# EAGLE board main (EAGLE 5.11)
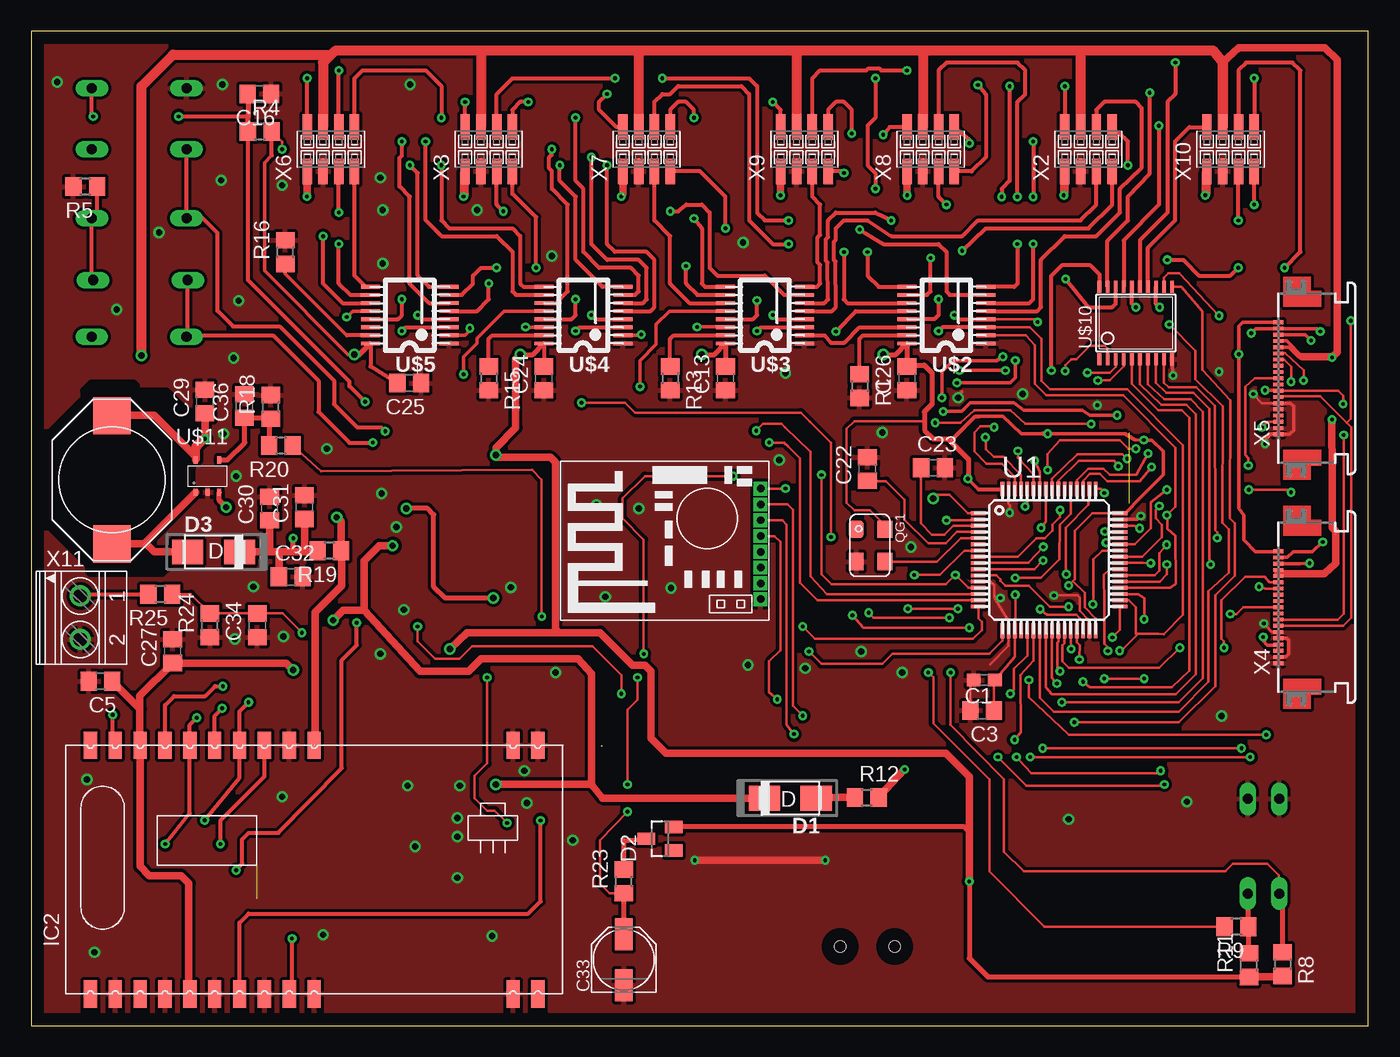
[diagram p3: board, top side]
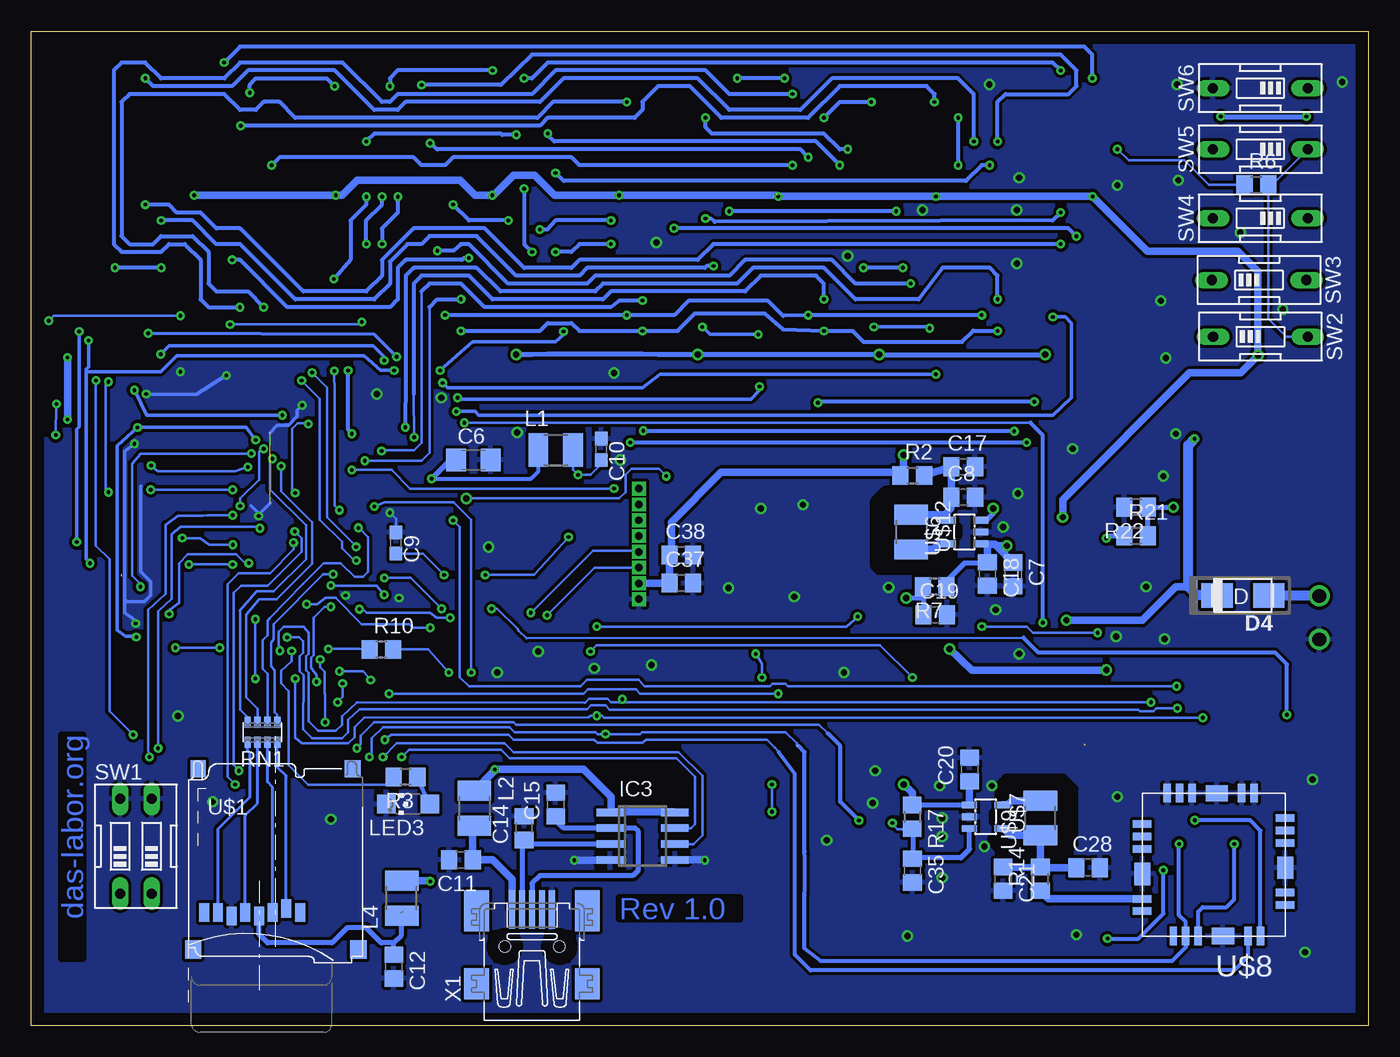
[diagram p4: board, bottom side, seen from below]

Size 107.62 x 80 mm. Coordinates in mm from the lower left corner, seen from the top.
Outline: 0,0 107.62,0 107.62,80 0,80 0,0
Copper layers (1*16): Top 0.035mm / dielectric 1.5mm / Bottom 0.035mm
Design rules "default *": minimum track width 0.15mm, minimum drill 0.3mm, track to track 0.15mm, track to pad 0.15mm, pad to pad 0.15mm, via to via 0.15mm, smd to smd 0.15mm, copper to edge 40mil, drill to drill 0.3mm, minimum pad ring 10mil, minimum via ring 8mil, stop-mask expansion 0.15mm, vias tented up to drill 0mil, thermal gap 10mil
tRestrict: area 1.4,37.1 to 12.9,50.5; area 8.3,47.1 to 13.4,51; area 4.7,36.5 to 11.1,38.2; area 4.3,50.8 to 8.4,51.6
bRestrict: area 33.5,36.6 to 39.8,43.1; area 27.2,13.6 to 30.3,15.2; area 23.7,13.8 to 29.8,19.9; area 25.1,15.9 to 30.2,17.4; area 33,39.2 to 38.1,40.5

## Footprints (pad centres in the part's own frame; a part is rotated, then mirrored left to right if it is on the bottom)
C0603 = smd 1.1 x 1: 1 -0.85,0; 2 0.85,0
C0805 = smd 1.3 x 1.5: 1 -0.95,0; 2 0.95,0
C1206 = smd 1.6 x 1.8: 1 -1.4,0; 2 1.4,0
PANASONIC_C = smd 2.6 x 1.4: + 2.05,0; - -2.05,0
DSMA = smd 2.5 x 2: A -2.083,0; C 2.083,0
SOT23 = smd 1 x 1.4: 1 -0.95,-1.1; 2 0.95,-1.1; 3 0,1.1
RFM_BP = smd 1.067 x 2.184: 1 30.62,13.65; 2 28.62,13.65; 3 12.62,13.65; 4 10.62,13.65; 5 8.62,13.65; 6 6.62,13.65; 7 4.62,13.65; 8 2.62,13.65; 9 0.62,13.65; 10 -1.38,13.65; 11 -3.38,13.65; 12 -5.38,13.65; 13 -5.38,-6.35; 14 -3.38,-6.35; 15 -1.38,-6.35; 16 0.62,-6.35; 17 2.62,-6.35; 18 4.62,-6.35; 19 6.62,-6.35; 20 8.62,-6.35; 21 10.62,-6.35; 22 12.62,-6.35; 23 28.62,-6.35; 24 30.62,-6.35
SO08 = smd 0.6 x 2.2: 1 -1.905,-2.6; 2 -0.635,-2.6; 3 0.635,-2.6; 4 1.905,-2.6; 5 1.905,2.6; 6 0.635,2.6; 7 -0.635,2.6; 8 -1.905,2.6
L1210 = smd 1.6 x 2.7: 1 -1.4,0; 2 1.4,0
PISM = smd 3 x 3: 1 -5.15,0; 2 5.15,0
CHIPLED_1206 = smd 1.5 x 1.5: A 0,-1.75; C 0,1.75
XO53 = smd 1.4 x 1.2: P$1 -1.3,-1.1; P$2 1.3,-1.1; P$3 1.3,1.2; P$4 -1.3,1.2
R0805 = smd 1.3 x 1.5: 1 -0.95,0; 2 0.95,0
CTS742C083 = smd 0.5 x 0.9: 1 -1.2,-0.8; 2 -0.4,-0.8; 3 0.4,-0.8; 4 1.2,-0.8; 5 1.2,0.8; 6 0.4,0.8; 7 -0.4,0.8; 8 -1.2,0.8
EDG-02 = drill 0.813 long: 1 -1.27,-3.81; 2 1.27,-3.81; 3 1.27,3.81; 4 -1.27,3.81
EDG-01 = drill 0.813 long: 1 0,-3.81; 2 0,3.81
TQFP64 = smd 1.2 x 0.3: 1 -5.7,3.75; 2 -5.7,3.25; 3 -5.7,2.75; 4 -5.7,2.25; 5 -5.7,1.75; 6 -5.7,1.25; 7 -5.7,0.75; 8 -5.7,0.25; 9 -5.7,-0.25; 10 -5.7,-0.75; 11 -5.7,-1.25; 12 -5.7,-1.75; 13 -5.7,-2.25; 14 -5.7,-2.75; 15 -5.7,-3.25; 16 -5.7,-3.75; 33 5.7,-3.75; 34 5.7,-3.25; 35 5.7,-2.75; 36 5.7,-2.25; 37 5.7,-1.75; 38 5.7,-1.25; 39 5.7,-0.75; 40 5.7,-0.25; 41 5.7,0.25; 42 5.7,0.75; 43 5.7,1.25; 44 5.7,1.75; 45 5.7,2.25; 46 5.7,2.75; 47 5.7,3.25; 48 5.7,3.75 | smd 0.3 x 1.2: 17 -3.75,-5.7; 18 -3.25,-5.7; 19 -2.75,-5.7; 20 -2.25,-5.7; 21 -1.75,-5.7; 22 -1.25,-5.7; 23 -0.75,-5.7; 24 -0.25,-5.7; 25 0.25,-5.7; 26 0.75,-5.7; 27 1.25,-5.7; 28 1.75,-5.7; 29 2.25,-5.7; 30 2.75,-5.7; 31 3.25,-5.7; 32 3.75,-5.7; 49 3.75,5.7; 50 3.25,5.7; 51 2.75,5.7; 52 2.25,5.7; 53 1.75,5.7; 54 1.25,5.7; 55 0.75,5.7; 56 0.25,5.7; 57 -0.25,5.7; 58 -0.75,5.7; 59 -1.25,5.7; 60 -1.75,5.7; 61 -2.25,5.7; 62 -2.75,5.7; 63 -3.25,5.7; 64 -3.75,5.7
ALPS_MICROSD = smd 0.8 x 1.5: 1 3.25,-3.25; 2 2.15,-2.95; 3 1.05,-3.25; 4 -0.05,-3.55; 5 -1.15,-3.25; 6 -2.25,-3.55; 7 -3.35,-3.25; 8 -4.45,-3.25 | smd 1.3 x 1.5: NC 7.95,-6.25; NC3 -5.35,-6.25 | smd 1.2 x 1.4: SW1 -4.95,8.3 | smd 1.3 x 1.4: SW2 7.5,8.3
TSSOP16 = smd 0.305 x 1.524: 1 -2.275,-3.169; 2 -1.625,-3.169; 3 -0.975,-3.169; 4 -0.325,-3.169; 5 0.325,-3.169; 6 0.975,-3.169; 7 1.625,-3.169; 8 2.275,-3.169; 9 2.275,3.169; 10 1.625,3.169; 11 0.975,3.169; 12 0.325,3.169; 13 -0.325,3.169; 14 -0.975,3.169; 15 -1.625,3.169; 16 -2.275,3.169
SOT23-5L = smd 0.55 x 1.2: 1 -0.95,-1.3; 2 0,-1.3; 3 0.95,-1.3; 4 0.95,1.3; 5 -0.95,1.3
SIM18 = smd 1.5 x 0.6: 1 -6,3; 2 -6,2; 4 -6,-2; 5 -6,-3; 6 -6,-4; 13 5.5,-3.5; 14 5.5,-2.5; 15 5.5,-1.5; 17 5.5,2.5; 18 5.5,3.5 | smd 0.6 x 1.5: 7 -3.5,-6; 8 -2.5,-6; 10 1.5,-6; 11 2.5,-6; 12 3.5,-6; 19 3,5.5; 20 2,5.5; 21 1,5.5; 23 -3,5.5; 24 -4,5.5 | smd 1.3 x 1.8: GND1 -6,0; GND3 5.5,0.5 | smd 1.8 x 1.3: GND2 -0.5,-6; GND4 -1,5.5
TSSOP20 = smd 0.305 x 0.991: 1 -2.925,-2.918; 2 -2.275,-2.918; 3 -1.625,-2.918; 4 -0.975,-2.918; 5 -0.325,-2.918; 6 0.325,-2.918; 7 0.975,-2.918; 8 1.625,-2.918; 9 2.275,-2.918; 10 2.925,-2.918; 11 2.925,2.918; 12 2.275,2.918; 13 1.625,2.918; 14 0.975,2.918; 15 0.325,2.918; 16 -0.325,2.918; 17 -0.975,2.918; 18 -1.625,2.918; 19 -2.275,2.918; 20 -2.925,2.918
TSOT23-5 = smd 0.33 x 0.584: 1 -0.95,-1.3; 2 0,-1.3; 3 0.95,-1.3; 4 0.95,1.3; 5 -0.95,1.3
RFM70 = drill 0.6 pad 0.61 square: P$1 -4.7,-7.7; P$2 -3.429,-7.7; P$3 -2.159,-7.7; P$4 -0.889,-7.7; P$5 0.381,-7.7; P$6 1.651,-7.7; P$7 2.921,-7.7; P$8 4.191,-7.7
32005-201 = smd 3.1 x 0.5: 1 3,1.6; 2 3,0.8; 3 3,0; 4 3,-0.8; 5 3,-1.6 | smd 2.5 x 2: M1 -3,-4.45; M2 -3,4.45 | smd 3.3 x 2: M3 2.9,4.45; M4 2.9,-4.45 | hole 0.9: 0,2.2; 0,-2.2
1296-08 = smd 0.76 x 2.05: 1 -1.905,-1.78; 2 -1.905,1.78; 3 -0.635,-1.78; 4 -0.635,1.78; 5 0.635,-1.78; 6 0.635,1.78; 7 1.905,-1.78; 8 1.905,1.78
52746-19 = smd 0.3 x 0.8: 1 -4.5,0.6; 2 -4,0.6; 3 -3.5,0.6; 4 -3,0.6; 5 -2.5,0.6; 6 -2,0.6; 7 -1.5,0.6; 8 -1,0.6; 9 -0.5,0.6; 10 0,0.6; 11 0.5,0.6; 12 1,0.6; 13 1.5,0.6; 14 2,0.6; 15 2.5,0.6; 16 3,0.6; 17 3.5,0.6; 18 4,0.6; 19 4.5,0.6
1751248 = drill 1.1 pad 1.7 round: 1 -1.75,-0.1; 2 1.75,-0.1

## Placement (x,y rotation side)
C1  100n  [C0603]  76.71,27.79 180 top
C3  100n  [C0805]  76.53,25.35 180 top
C5  100n  [C0805]  5.58,27.7 180 top
C6  4u7  [C1206]  72.03,45.51 0 bottom
C7  4µ7  [C0805]  28.6,36.3 270 bottom
C8  10µ  [C0805]  32.6,42.5 0 bottom
C9  100n  [C0603]  78.26,38.81 270 bottom
C10  100n  [C0603]  61.75,46.35 270 bottom
C11  10n  [C0805]  73.03,13.34 180 bottom
C12  4u7  [C0805]  78.44,4.74 270 bottom
C13  100n  [C0805]  55.88,52.07 90 top
C14  47p  [C0805]  67.94,15.88 90 bottom
C15  47p  [C0805]  65.41,17.78 90 bottom
C16  100n  [C0805]  18.38,74.94 180 top
C17  10µ  [C0805]  32.6,44.95 0 bottom
C18  100n  [C0805]  30.66,36.33 270 bottom
C19  100n  [C0805]  34.86,33.05 0 bottom
C20  4µ7  [C0805]  32.1,20.6 90 bottom
C21  10µ  [C0805]  29.4,11.8 270 bottom
C22  10p  [C0805]  67.3,44.77 90 top
C23  10p  [C0805]  72.58,44.88 0 top
C24  100n  [C0805]  41.27,52.07 90 top
C25  100n  [C0805]  30.43,51.68 180 top
C26  100n  [C0805]  70.48,52.07 90 top
C27  4u7  [C0805]  11.4,30.11 90 top
C28  10µ  [C0805]  22.55,12.7 0 bottom
C29  4µ7  [C0805]  14,50.2 90 top
C30  10µ  [C0805]  19.2,41.6 90 top
C31  10µ  [C0805]  22,41.7 90 top
C32  4µ7  [C0805]  20.9,36.1 0 top
C33  VF 100/6,3 K-C  [PANASONIC_C]  47.7,5.3 90 top
C34  100n  [C0805]  18.2,32.2 90 top
C35  100n  [C0805]  36.7,12.46 270 bottom
C36  220n  [C0805]  17.17,49.84 90 top
C37  100n  [C0805]  55.3,35.6 0 bottom
C38  1µ  [C0805]  55.3,37.85 0 bottom
D1  [DSMA]  61.1,18.3 180 top
D2  BAS70-05  [SOT23]  50.62,15.03 90 top
D3  [DSMA]  14.7,38.1 0 top
D4  [DSMA]  10.1,34.6 180 bottom
IC2  RFM12BP  [RFM_BP]  10.16,8.89 0 top
IC3  USB6B1  [SO08]  58.42,15.24 270 bottom
L1  10,0µ  [L1210]  65.4,46.3 0 bottom
L2  1,0µ  [L1210]  71.94,17.48 270 bottom
L3  L-EUPISM  [PISM]  6.5,43.9 270 top
L4  100µ  [L1210]  77.8,10.25 90 bottom
LED3  [CHIPLED_1206]  77.28,17.82 90 bottom
QG1  CRYSTALRESONATORXO53  [XO53]  67.5,38.62 270 top
R1  100k  [R0805]  66.67,51.44 270 top
R2  0  [R0805]  36.7,44.25 0 bottom
R3  330  [R0805]  77.49,19.99 180 bottom
R4  100k  [R0805]  18.4,71.94 0 top
R5  22k  [R0805]  4.36,67.48 180 top
R6  22k  [R0805]  9.02,67.64 0 bottom
R7  1k  [R0805]  34.9,35.3 180 bottom
R8  100k  [R0805]  100.7,4.94 270 top
R9  100k  [R0805]  96.99,7.95 180 top
R10  100k  [R0805]  79.44,30.26 0 bottom
R11  100k  [R0805]  98,4.86 90 top
R12  0  [R0805]  67.25,18.35 0 top
R13  100k  [R0805]  51.44,52.07 270 top
R14  0  [R0805]  26.4,11.8 90 bottom
R15  100k  [R0805]  36.83,52.07 270 top
R16  100k  [R0805]  20.46,62.22 90 top
R17  100k  [R0805]  36.71,16.79 270 bottom
R18  100k  [R0805]  19.3,49.77 90 top
R19  0  [R0805]  24,38.2 180 top
R20  10k  [R0805]  20.1,46.65 180 top
R21  84k5  [R0805]  18.7,39.4 0 bottom
R22  10k  [R0805]  18.7,41.7 180 bottom
R23  1k  [R0805]  47.7,11.6 90 top
R24  100k  [R0805]  14.4,32.2 90 top
R25  100k  [R0805]  10.4,34.7 180 top
RN1  742C083820JPCT-ND  [CTS742C083]  89,23.6 180 bottom
SW1  [EDG-02]  99.19,14.43 0 bottom
SW2  [EDG-01]  8.69,55.42 270 bottom
SW3  [EDG-01]  8.8,59.98 270 bottom
SW4  [EDG-01]  8.7,64.94 90 bottom
SW5  [EDG-01]  8.7,70.49 90 bottom
SW6  [EDG-01]  8.7,75.41 90 bottom
U1  STM32F10XRXT6  [TQFP64]  81.92,37.47 0 top
U$1  MICROSDA  [ALPS_MICROSD]  89.23,12.36 0 bottom
U$2  PCA9922  [TSSOP16]  73.66,57.15 90 top
U$3  PCA9922  [TSSOP16]  59.05,57.15 90 top
U$4  PCA9922  [TSSOP16]  44.45,57.15 90 top
U$5  PCA9922  [TSSOP16]  30.48,57.15 90 top
U$6  LM3671  [SOT23-5L]  32.5,39.7 90 bottom
U$7  XC9235  [SOT23-5L]  30.8,16.8 270 bottom
U$8  SIM18  [SIM18]  12.7,12.7 180 bottom
U$9  LQH3C 4,7µ  [L1210]  26.4,16.7 90 bottom
U$10  74AHC573  [TSSOP20]  88.9,56.52 0 top
U$11  LT1935  [TSOT23-5]  14.2,44.2 0 top
U$12  2,2µ  [L1210]  36.8,39.7 270 bottom
U$13  RFM70  [RFM70]  51,39 90 top
X1  MINI-USB-32005-201  [32005-201]  67.31,6.35 90 bottom
X2  1296-T08  [1296-08]  85.09,70.48 0 top
X3  1296-T08  [1296-08]  36.83,70.48 0 top
X4  52746-19  [52746-19]  100.97,33.66 90 top
X5  52746-19  [52746-19]  100.97,52.07 90 top
X6  1296-T08  [1296-08]  24.13,70.48 0 top
X7  1296-T08  [1296-08]  49.53,70.48 0 top
X8  1296-T08  [1296-08]  72.39,70.48 0 top
X9  1296-T08  [1296-08]  62.23,70.48 0 top
X10  1296-T08  [1296-08]  96.52,70.48 0 top
X11  1751248  [1751248]  4.06,32.81 270 top

## Tracks (layer width: path | path; a pad name or v marks a point on that pad's centre or on a via)
B1  (via drill 0.3)
  Top 0.305: U$4.5 49.85,57.48 50.16,57.78 50.16,61.59 49.53,62.23 46.99,62.23 46.35,62.87 v46.35,69.22 | v88.27,69.22 88.27,71.12 87.63,71.75 87.5,71.75 X2.8
  Bottom 0.305: v46.35,69.22 63.5,69.22 64.14,69.85 73.66,69.85 74.3,69.22 76.2,69.22 76.83,69.85 87.63,69.85 v88.27,69.22
B2  (via drill 0.3)
  Top 0.305: U$4.6 49.23,58.12 49.53,58.42 49.53,60.96 48.9,61.59 46.35,61.59 45.09,62.87 v45.09,69.85 | v75.52,70.97 75.49,71.27 X8.8
  Bottom 0.305: v45.09,69.85 45.72,70.48 74.93,70.48 v75.52,70.97
B3  (via drill 0.3)
  Top 0.305: U$4.7 48.62,58.77 48.9,59.05 48.9,60.33 48.26,60.96 45.72,60.96 44.45,62.23 44.45,67.31 43.81,67.94 v43.81,73.03 | X3.8 38.73,73.66 39.37,74.3 v40.01,74.3
  Bottom 0.305: v43.81,73.03 42.55,74.3 v40.01,74.3
B4  (via drill 0.3)
  Top 0.305: U$4.8 45.98,59.42 43.81,61.59 43.81,66.67 42.55,67.94 v42.55,69.22 | v66.04,71.75 66.04,73.66 65.41,74.3 64.77,74.3 64.14,73.66 X9.8
  Bottom 0.305: v42.55,69.22 44.45,71.12 65.53,71.12 66.04,71.63 v66.04,71.75
B5  (via drill 0.3)
  Top 0.305: U$4.9 39.63,59.42 39.37,59.69 39.37,63.5 38.73,64.14 33.66,64.14 33.02,64.77 v33.02,69.22 | X6.8 26.04,76.2 26.67,76.83 31.75,76.83 33.02,75.56 v33.02,73.03
  Bottom 0.305: v33.02,73.03 v33.02,69.22
B6  (via drill 0.3)
  Top 0.305: U$4.10 39.02,58.77 38.73,59.05 38.73,62.23 37.47,63.5 33.02,63.5 31.75,64.77 v31.75,71.12 | v98.42,76.2 X10.8
  Bottom 0.305: v31.75,71.12 31.75,74.93 33.02,76.2 43.18,76.2 45.72,73.66 51.44,73.66 53.98,76.2 64.77,76.2 66.67,74.3 77.47,74.3 78.11,73.66 80.01,73.66 83.19,76.83 90.17,76.83 91.44,75.56 97.79,75.56 v98.42,76.2
B7  (via drill 0.3)
  Top 0.305: U$4.11 42.25,58.12 43.18,59.05 43.18,66.04 41.91,67.31 41.91,68.74 41.7,68.95 41.7,69.85 41.9,70.05 v41.91,70.48 | X7.8 51.44,73.66 52.07,74.3 52.7,74.3 53.34,73.66 v53.34,73.03
  Bottom 0.305: v41.91,70.48 42.55,70.48 43.81,71.75 52.83,71.75 53.34,72.27 v53.34,73.03
B8  (via drill 0.3)
  Top 0.3: X5.19 97.51,56.57 97.19,56.25 v97.19,54 97.2,41.6 97.59,41.06 97.59,39.06 98.53,38.12 100.33,38.12 | U$4.12 38.08,57.48 35.9,55.3 35.9,54.9 34.8,53.8 v34.8,52.4 | v74.5,51.7 78.8,51.7 79.2,52.1 v79.2,53.5
  Top 0.305: 100.33,38.12 X4.19
  Bottom 0.3: v34.8,52.4 57,52.4 58.4,51.3 74.1,51.3 v74.5,51.7 | v79.2,53.5 79.2,53.8 80.1,54.7 96.49,54.7 v97.19,54
BATTERY
  Top 0.305: R25.2 4.1,34.7 X11.1
  Bottom 0.813: X11.1 7.98,34.56 D4.A
BOOT0  (via drill 0.3)
  Top 0.2: U1.60 80.17,41.91 v80,41.75 | R9.2 81.55,7.95 77.1,12.4 77.1,19.8 72.6,24.3 72.6,28 v72.2,28.4
  Bottom 0.2: v72.2,28.4 72.2,40.7 73.6,42.1 79.15,42.1 v80,41.75
G1
  Top 0.305: U$3.5 64.46,57.48 64.77,57.78 64.75,61.45 64.6,61.6 64.6,63.05 64.77,63.22 64.77,64.14 65.41,64.77 67.31,64.77 69.22,63.5 74.93,63.5 76.2,64.77 84.45,64.77 85.72,66.04 X2.5
G2  (via drill 0.3)
  Top 0.305: U$3.6 63.84,58.12 64.14,58.42 64.1,61.4 63.95,61.55 63.95,63.25 64.14,63.44 64.14,64.77 64.77,65.41 67.94,65.41 v69.22,64.77 | v73.66,66.04 73.03,66.67 X8.5
  Bottom 0.305: v73.66,66.04 72.39,64.77 v69.22,64.77
G3  (via drill 0.3)
  Top 0.305: U$3.7 60.6,58.77 59.05,60.33 55.24,60.33 54.61,60.96 54.61,65.41 53.98,66.04 52.7,66.04 52.07,65.5 v51.44,65.5 | X3.5 37.47,66.04 v38,65.5
  Bottom 0.305: v38,65.5 38.2,65.5 38.3,65.5 v51.44,65.5
G4
  Top 0.305: U$3.8 63.23,59.42 63.5,59.69 63.5,61.2 63.3,61.4 63.3,63.4 63.5,63.6 63.5,66.04 62.87,66.67 X9.5
G5  (via drill 0.3)
  Top 0.305: U$3.9 54.24,59.42 53.98,59.69 53.98,64.14 v53.34,64.92 | v24.77,65.41 X6.5
  Bottom 0.305: v53.34,64.92 52.92,64.92 52.6,64.65 25.4,64.77 v24.77,65.41
G6  (via drill 0.3)
  Top 0.305: v97.16,64.77 X10.5 | U$3.10 53.62,58.77 52.7,59.69 v52.7,61.11
  Bottom 0.305: v52.7,61.11 53.24,61.11 53.4,60.95 62.87,60.96 63.5,60.33 68.58,60.33 71.75,63.5 75.56,63.5 76.2,62.87 77.32,62.87 78.74,61.45 78.74,59.69 80.01,58.42 86.36,58.42 90.81,62.87 92.71,62.87 94.61,64.77 v97.16,64.77
G7
  Top 0.305: X7.5 50.16,64.77 51.44,63.5 51.44,59.69 53,58.12 U$3.11
G8  (via drill 0.3)
  Top 0.3: v103.74,55.84 103.5,56.07 X5.18 98.57,56.07 v98.2,55.7 | X4.18 101.09,37.66 101.56,38.12 103.11,38.12 v103.94,38.9 | U$3.12 51.38,57.48 50.3,56.4 50.3,54.8 49,53.5 v49,51.4 | v73.3,50.5 73.3,52.6 74.2,53.5 77.7,53.5 v78.2,53.8
  Bottom 0.3: v103.74,55.84 103.74,48.16 103.95,47.95 v103.94,38.9 | v49,51.4 49,51.1 49.7,50.4 73.1,50.4 v73.3,50.5 | v78.2,53.8 80,55.6 v98.2,55.7
GND  (via drill 0.3, 0.5)  (1 unrouted)
  Top 0.2: U1.63 78.67,41.96 78.75,41.88 v78.75,41.25 | U1.12 77.21,35.72 77.51,35.41 77.51,34.4 78.67,32.55 U1.18 | U1.18 78.67,30.54 77.19,29.06 | X5.5 X5.6 99.03,50.07 v98.35,50.8 | 91.8,53.37 U$10.10 | U1.18 78.67,31.86 78.7,31.9 | U1.31 85.14,31.77 85.1,31.8 85.1,32.65 84.4,33.35 84.4,34.4 84.2,34.6 v82.3,34.6 | C3.2 75.58,27.62 C1.2
  Top 0.25: X4.2 X4.1 | X4.6 99.89,31.66 v99.2,32.35
  Top 0.3: X5.1 101.27,47.57 101.6,47.9 101.6,49.8 101.33,50.07 X5.6 | X5.1 X5.2 | v91.9,52.3 91.8,53.37 | X4.6 X4.5 101.05,31.16 101.2,31 101.2,29.9 100.95,29.66 X4.2 | v99.3,46.8 99.3,47.1 99.8,47.6 100.33,47.6 X5.1 | U1.47 89.02,40.72 v89.3,41 | 74.4,50.5 74.9,51
  Top 0.61: v53.4,13.3 v63.9,13.3
  Bottom 0.2: C9.1 78.26,40.76 v78.75,41.25 | v82.3,34.6 82.2,34.6
  Bottom 0.3: v98.35,50.8 94.3,50.8 v91.9,52.3 | v99.2,32.35 99.25,32.6 100.1,33.2 100.1,34.3 | 100.1,34.3 100.1,46.2 v99.3,46.8 | 89.9,41.8 89.3,41.2 v89.3,41 89.3,41.1 88.4,42 | 98.8,43.4 98.8,36.5 98,35.7 98,34.6 98.5,34.1 99.9,34.1 100.1,34.3 | 88.4,47.7 87.8,48.3 86.9,48.3 86.2,49 86.2,49.5 v85.8,49.9
  Bottom 0.61: IC3.5 53.44,13.34 v53.4,13.3 | v63.9,13.3 61.05,13.3 IC3.4
  other vias: 34.3,15.2 34.3,16.7 30.9,14.4 34.5,19.3 30.3,19.3 34.3,11.9 16.5,44.2 15.5,47.6 20.3,31.3 39.9,17.9 43.6,14.9 17.9,35.3 30,33.45 29.4,40.1 38.6,35.25 28.2,42.8 78,34.4 39.7,20.5 28.1,29.9 42.2,28.4 62.3,28.75 57.7,29 70.1,28.4 83.5,16.6 93,18 37.1,7.2 23.5,7.3 20.2,18.4 5.1,5.9 4.5,19.8 16.4,31.1 60.7,52.5 68.5,47.7 60.2,45.5 48.9,41.6 28.1,68.2 28.3,61.3 41.9,61.9 57.3,63 95.8,24.9 66.8,30.1 23.8,46.4 15.3,68 2.1,75.9 6.9,57.6 16.3,53.7 30.5,75.7 74.6,50.5 79.8,50.8 95.6,52.6 70.8,38.5 10.3,63.8 28.3,65.6 35.9,65.6 16.7,58.3 20.2,67.6 15.4,75.7 46.2,34.5 45.5,41.9 51.5,35.2
  pour Top (isolate 0.254): 0,0 107.95,0 107.95,80.01 0,80.01
  pour Bottom (isolate 0.254): 107.95,0 107.95,80.01 0,80.01 0,0
M1  (via drill 0.3)
  Top 0.305: U$5.5 35.88,57.48 36.83,58.42 v36.83,59.69 | X2.7 87,66.04 85.09,64.14 76.83,64.14 v74.93,62.33
  Bottom 0.305: v36.83,59.69 41.27,59.69 43.18,61.59 50.16,61.59 51.44,60.33 62.23,60.33 62.87,59.69 69.22,59.69 72.39,62.87 73.03,62.87 73.61,62.33 v74.93,62.33
M2  (via drill 0.3)
  Top 0.305: X8.7 75.69,68.7 76.83,69.85 76.83,74.93 v76.2,75.67 | v29.84,71.12 29.84,70 29.65,69.8 29.64,67.51 30.48,66.67 30.48,59.69 32.05,58.12 U$5.6
  Bottom 0.305: v76.2,75.67 69.8,75.67 67.31,78.11 24.77,78.11 23.5,76.83 23.5,75.56 24.13,74.93 29.21,74.93 29.84,74.3 v29.84,71.12
M3  (via drill 0.3)
  Top 0.305: X3.7 38.73,66.91 40.64,65.04 v40.64,60.96 | U$5.7 34.65,58.77 35.56,59.69 35.56,60.33 36.2,60.96 v37.47,60.96
  Bottom 0.305: v37.47,60.96 v40.64,60.96
M4  (via drill 0.3)
  Top 0.305: U$5.8 32.02,59.42 31.11,60.33 31.11,68.58 v30.48,69.22 | X9.7 65.28,68.7 v65.41,68.58
  Bottom 0.305: v30.48,69.22 31.11,69.22 32.38,67.94 64.77,67.94 v65.41,68.58
M5
  Top 0.305: U$5.9 26.93,59.42 26.04,60.33 X6.7
M6  (via drill 0.3)
  Top 0.305: U$5.10 25.68,58.77 24.77,59.69 v24.77,62.87 | v98.42,66.04 X10.7
  Bottom 0.305: v24.77,62.87 52.7,62.87 53.98,61.59 63.5,61.59 64.14,60.96 67.94,60.96 71.12,64.14 76.83,64.14 79.38,61.59 79.38,60.33 80.64,59.05 85.72,59.05 90.81,64.14 92.71,64.14 93.98,65.41 95.89,65.41 96.52,66.04 v98.42,66.04
M7  (via drill 0.3)
  Top 0.305: X7.7 53.85,68.7 55.88,66.67 v55.88,64.14 | v23.5,63.5 23.5,59.69 25.06,58.12 U$5.11
  Bottom 0.305: v55.88,64.14 24.13,64.14 v23.5,63.5
M8  (via drill 0.3)
  Top 0.2: X4.8 105.16,32.66 105.62,33.12 v105.62,47.5 | v105.58,50 105.58,50.67 105.18,51.07 X5.8
  Top 0.3: U$5.12 25.88,57.48 v25.4,57 | v73.4,49.4 74.9,49.4 75.6,50.1 79.1,50.1 79.9,49.5 84.6,49.5 85.2,49.1 v87.4,49.1 | v99.3,51.1 100.39,51.1 X5.8
  Bottom 0.2: v105.58,50 v105.62,47.5
  Bottom 0.3: v25.4,57 24.4,57 23.9,56.5 23.9,50.5 25.4,49.1 71.6,49.1 71.9,49.4 v73.4,49.4 | v87.4,49.1 98.3,49.1 v99.3,51.1
N$2  (via drill 0.3)
  Top 0.2: U1.13 75.41,35.22 v74.38,36.25 73.62,35.5 64.4,35.5 63.6,36.3 v63.6,44.3
  Bottom 0.2: C9.2 76.09,37.97 v74.38,36.25 | L1.2 64,44.7 v63.6,44.3 62.6,44.3 61.9,45 C10.2
N$3
  Top 0.406: R23.2 47.7,14.88 D2.3
N$4
  Bottom 0.406: U$1.4 89.28,7.33 88.6,6.64 83.4,6.65 82.2,7.85 80.65,7.85 79.44,6.64 78.44,6.64 | 78.44,6.64 77.8,7.28 L4.1 | C12.1 78.44,6.64
N$5
  Bottom 0.254: U$1.2 87.08,20.08 87.8,20.8 RN1.8
N$6
  Bottom 0.406: 72.08,15.89 71.94,15.89 L2.2
  Bottom 0.61: X1.1 68.91,11.76 70.48,13.34 C11.1 72.08,15.89
N$7
  Top 0.2: U1.4 74.52,39.72 73.6,38.8 72.2,38.8 70.3,40.7 70.3,42.3 68.8,43.8 67.33,43.8 C22.1
N$8
  Bottom 0.406: IC3.3 67.62,14.61 C14.1 68.11,14.76 X1.2
N$9
  Bottom 0.406: C15.1 65.41,16.51 64.77,15.88 IC3.2 59,15.88 58.75,15.62 58.75,12.5 59.19,12.06 66.67,12.06 67.31,11.43 X1.3
N$10
  Bottom 0.305: LED3.A R3.1
N$11
  Bottom 0.254: U$1.3 88.18,19.18 88.6,19.6 RN1.7
N$12
  Top 0.2: U1.3 74.22,40.22 73.5,39.5 72.5,39.5 71.6,40.4 71.6,44.85 C23.1
N$13
  Top 0.305: U$2.14 66.67,56.17 65.44,54.95 64.33,54.95 63.85,55.52 U$3.2
N$14  (via drill 0.3)
  Top 0.3: U$4.2 49.02,55.52 v49.1,55.6 | v53.6,56.2 55.86,56.2 U$3.14
  Bottom 0.3: v49.1,55.6 53,55.6 v53.6,56.2
N$15  (via drill 0.3)
  Top 0.3: U$4.14 39.92,56.17 v39.8,56.2 | v35.3,56.1 35.3,55.9 34.92,55.52 U$5.2
  Bottom 0.3: v39.8,56.2 35.4,56.2 v35.3,56.1
N$16  (via drill 0.3, 0.5)
  Top 0.61: L3.1 6.55,49.1 9.9,49.1 13.25,45.75 U$11.5 13.3,45.55 13.3,46.6 | v14,47.2 C29.1 | 26.8,33.4 25.1,33.4 v24.3,32.6 | 26.8,33.4 31.3,28.5 35.2,28.5 36.2,29.5 44,29.5 45.1,28.3 45.1,19.5 | 26.8,33.4 26.8,37.4 28,38.6 v29.1,38.6 | D1.C 46,18.3 45.2,19.3 45.1,19.5 | v37.4,19.4 45.1,19.4 45.1,19.5
  Top 0.813: v14,47.2 13.9,47.2 13.3,46.6
  Bottom 0.406: U$7.1 R17.1 | R7.1 33.95,35.75 32.5,37.2 30.74,37.2 C18.1 | U$6.1 30.7,38.75 30.66,38.71
  Bottom 0.61: U$7.1 C20.1 | 14.5,35.3 15.5,35.3 18.2,32.6 v24.3,32.6 | R17.1 36.71,18.71 v37.4,19.4 | 29.82,38.48 C7.1 | 29.82,38.48 30.06,38.71 30.66,38.71 C18.1 | v29.1,38.6 29.7,38.6 29.82,38.48
  Bottom 0.813: D4.C 13.8,34.6 14.5,35.3 14.5,46.7 v14,47.2
N$17  (via drill 0.5)
  Top 0.406: v30.2,41.6 31.9,41.6 32.4,41.1 32.4,35.3 33.3,34.4 v37.2,34.4
  Bottom 0.406: U$6.3 30.75,40.65 30.2,41.2 v30.2,41.6 | v37.2,34.4 36,34.4 | 36,34.4 36,35.45 R7.2 | C19.1 35.81,34.31 35.9,34.4 36,34.4
N$18
  Bottom 0.61: U$6.4 34.25,40.65 34.7,41.1 | 34.7,41.1 U$12.1 | 34.7,41.1 34.1,41.1 33.6,41.6 33.6,42.45 C8.1 C17.1 R2.2
N$19
  Top 0.2: QG1.P$3 69.5,37.3 72.9,37.3 74.81,39.22 U1.5
N$20
  Bottom 0.61: U$7.5 29.05,17.75 28.7,18.1 U$9.2
N$21
  Bottom 0.61: C21.1 26.45,12.7 R14.2 | C28.1 26.35,12.7 R14.2 | R14.2 U$9.1 28.8,15.3 29.35,15.85 U$7.4
N$22
  Bottom 0.61: U$6.5 34.55,38.75 35,38.3 U$12.2
N$23  (via drill 0.3)
  Top 0.2: v74,28.4 74,24.2 78.3,19.8 78.3,14 79.9,12.4 96.1,12.4 96.7,13 99.5,13 100.4,12.1 100.4,10.68 SW1.1
  Top 0.406: R8.1 100.7,10.38 SW1.1
  Bottom 0.2: R10.2 75.66,30.26 v74,28.4
N$24
  Top 0.406: SW1.2 97.94,10.6 R9.1 98,7.89 R11.2
N$25
  Top 0.305: U$2.15 66.95,55.52 66.67,55.24 R1.1
N$26
  Top 0.305: U$3.15 51.72,55.52 51.44,55.24 R13.1
N$27
  Top 0.305: U$4.15 37.11,55.52 36.83,55.24 R15.1
N$28
  Top 0.3: R16.1 20.46,60.47 25.41,55.52
  Top 0.305: U$5.15 25.41,55.52
N$29
  Top 0.406: U$11.4 15.8,45.5 17.2,46.9 17.2,48.85 C36.1 17.18,48.9 18.9,48.9 18.98,48.83 R18.1 19.15,48.78 R20.2
N$31  (via drill 0.3, 0.5)
  Top 0.2: U1.1 75.39,41.22 73.9,42.7 72.9,42.7 v72.6,42.4 | v56.5,44.2 49.4,44.2 47.6,42.4 47.6,40.8 49.3,39.1 v49.3,29.9 | R23.1 46.55,10.65 45.8,11.4 45.8,14.9 v48,17.2 | v48,19.4 48,25.4 48.8,26.2 v48.8,28
  Top 0.406: C33.+ R23.1
  Bottom 0.2: v72.6,42.4 60.3,42.4 59.8,42.9 59.8,44.3 59.3,44.8 57.1,44.8 v56.5,44.2 | v48,17.2 v48,19.4 | v48.8,28 48.8,29.1 v49.3,29.9
N$32
  Bottom 0.2: SW5.1 7.75,67.64 R6.2 8.07,56.87 6.6,55.4 4.9,55.4 SW2.2
N$33  (via drill 0.3)
  Top 0.406: v21.1,39.2 21.1,38.2 20.8,38.1
  Top 0.61: D3.C 19.3,38.1 | 19.3,38.1 19.9,38.1 | 19.9,38.1 20.8,38.1 22.1,38.1 | 22.1,38.1 22.65,38.1 R19.2 | C32.1 19.95,38.05 19.9,38.1 | C30.1 19.2,38.2 19.3,38.1 | C31.1 22,38.2 22.1,38.1
  Bottom 0.406: R21.1 20.8,39.4 v21.1,39.2
N$34
  Top 0.305: R5.1 5.31,65.36 SW4.1 4.89,60.08 SW3.2
N$35  (via drill 0.5)
  Top 0.406: U$11.3 15.15,42.25 v15.7,41.7
  Bottom 0.406: v15.7,41.7 R22.1 R21.2
N$36
  Top 0.61: L3.2 9.1,38.75 9.18,38.83 | 9.18,38.83 U$11.1 | D3.A 9.9,38.1 9.18,38.83
N$37
  Bottom 0.254: U$1.7 92.58,15.82 90,18.4 90,21.9 90.2,22.1 RN1.5
N$38
  Bottom 0.254: U$1.5 90.38,16.92 89.4,17.9 RN1.6
N$72
  Top 0.61: R12.1 64.83,18.35 D1.A
PA0  (via drill 0.3)
  Top 0.2: U1.14 64.03,34.72 62.73,36.12 62.73,46.15 60.65,48.12 60.38,48.4 58.9,48.4 v58.35,47.85
  Top 0.305: SW5.2 SW4.2 13.8,64.94 15,63.75 15,57.5 16.25,56.25 20,56.25 24.38,51.88 24.38,50 26.25,48.12 28.18,48.12 v28.5,47.8
  Bottom 0.305: v28.5,47.8 58.3,47.8 v58.35,47.85
PA1  (via drill 0.3)
  Top 0.2: 60.9,46.6 61.88,45.62 61.88,35.62 63.28,34.22 U1.15 | 60.9,46.6 60.62,46.88 | v59.4,46.9 60.6,46.9 60.9,46.6
  Top 0.305: 12.61,55.53 SW3.1 | SW2.1 12.61,55.53 | 12.61,55.53 19.47,55.53 23.12,51.88 23.12,49.38 25.62,46.88 27.48,46.88 v27.5,46.9
  Bottom 0.305: v27.5,46.9 v59.4,46.9
PA2  (via drill 0.3)
  Top 0.2: U1.16 76.22,32.78 76.5,32.5 76.5,31.8 75.8,31.1 63.1,31.1 v62.1,32.1 | v41.1,32.9 41.1,43.9 40.3,44.7 23.35,44.6 R20.1
  Bottom 0.2: v62.1,32.1 42,32.1 v41.1,32.9
PA3  (via drill 0.3)
  Top 0.2: U1.17 78.17,30.96 77.1,29.9 69.3,29.9 68.5,29.1 63.6,29.1 v62.6,30.1 | v36.7,28 36.7,21.1 35.7,20.1 35.7,18.3 36.7,17.3 37.3,17.3 v38.3,16.3
  Bottom 0.2: v62.6,30.1 62.1,30.6 39.3,30.6 v36.7,28 | v38.3,16.3 38.3,16.2 37.9,15.8 36.75,15.8 R17.2
  Bottom 0.406: U$7.3 32.1,14.2 32.8,13.5 36.6,13.5 | 36.6,13.5 C35.1 | 36.6,13.5 36.6,15.73 R17.2
PA5  (via drill 0.3)
  Top 0.2: R25.1 12.85,34.7 R24.2 C34.2 20.25,33.15 v21.8,31.6 | v31.1,32.1 31.1,30.9 32.5,29.5 34.5,29.5 35.5,30.5 45.2,30.5 47.5,28.2 v47.5,26.7 | U1.21 80.17,29.77 79.1,28.7 79.1,27 v78.8,26.7
  Bottom 0.2: v21.8,31.6 27,31.6 27.5,32.1 v31.1,32.1 | v47.5,26.7 58.6,26.7 58.95,27.05 62.8,27.05 63.15,26.7 v78.8,26.7
PA6  (via drill 0.3)
  Top 0.2: U1.22 80.64,31.75 80.64,29.34 79.6,28.2 79.64,23.59 v79.14,23
  Bottom 0.2: 47.44,22 47.74,22.34 48.4,23 58.15,23 58.4,22.75 62.05,22.75 62.3,23 68.8,23 69.2,23.4 78.64,23.4 v79.14,23
  Bottom 0.305: U$8.23 9.7,5.54 10.79,4.45 44.88,4.45 46.15,5.71 46.15,20.24 47.44,22
PA7  (via drill 0.3)
  Top 0.2: U$2.4 80.8,56.83 81.03,56.6 v81,56.6 | U1.23 81.2,29.2 81.17,28.16 81.17,26.39 82.31,25.23 92.34,25.23 94.75,27.64 94.75,34.92 96.39,36.41 96.39,39.91 95.85,40.45 95.89,49.81 93.7,52 93.7,54.3 v91.6,56.4
  Top 0.305: U$2.4 74.62,56.83 v74.3,57.15 | U$3.4 60.02,56.83 v59.69,57.15 | U$4.4 45.41,56.83 v45.09,57.15 | U$5.4 31.44,56.83 v31.11,57.15
  Bottom 0.2: v91.6,56.4 81.2,56.4 v81,56.6
  Bottom 0.305: v74.3,57.15 v59.69,57.15 55.85,57.15 54.7,58.3 48.3,58.3 47.1,57.1 v45.09,57.15 v31.11,57.15
PA8  (via drill 0.3)
  Top 0.2: U$13.P$8 v60.69,43.19 v60.7,43.2 | v81.8,44.7 81.8,45.95 82.8,47.1 87.6,47.1 88.3,46.4 v88.9,46.4 | U1.41 89.42,37.72 91,39.3 91,40.3 90.5,40.8 90.5,41.5 v90.8,41.8
  Bottom 0.2: v60.7,43.2 77.1,43.2 78.6,44.7 v81.8,44.7 | v90.8,41.8 90.8,42.4 89.25,43.9 89.25,46.15 v88.9,46.4
PA9  (via drill 0.3)
  Top 0.2: U1.42 86.22,38.22 85.5,37.5 85.5,34.3 v85.45,33.9 | v66.1,33 67,32 v75.5,32
  Bottom 0.2: v85.45,33.9 84.6,33.9 83.9,34.4 83.1,34.4 81,32.3 77.2,32.3 76.9,32 v75.5,32 | U$13.P$3 62.26,36.84 v66.1,33
PA10  (via drill 0.3)
  Top 0.2: U1.43 88.81,38.72 90.1,40 90.1,42.1 v91.4,43.1 | X5.13 100.83,53.57 101.4,53 v101.4,51.8 | v98,43.1 101.2,43.1 v101.4,42.9
  Bottom 0.2: v91.4,43.1 v98,43.1 | v101.4,42.9 101.5,42.9 101.6,43.2 101.6,51.7 v101.4,51.8
PA11  (via drill 0.3)
  Top 0.2: U1.44 86.92,39.22 v86.5,38.85 | v77.8,21.6 80.1,19.3 91,19.3 v91.2,19.4
  Bottom 0.2: v86.5,38.85 86.5,38.3 88.4,36.4 90.9,36.4 91.8,35.5 91.8,20 v91.2,19.4 | IC3.7 54.52,15.88 54.2,16.2 54.2,20 55.7,21.5 69.1,21.5 69.8,22.2 77.2,22.2 v77.8,21.6
PA12  (via drill 0.3)
  Top 0.2: U1.45 86.42,39.72 v86.4,39.75 | v79.3,21.6 79.5,21.4 80.5,20.3 90.7,20.3 v90.9,20.5
  Bottom 0.2: v86.4,39.75 85.85,39.2 85.85,38.1 88.6,35.4 90.7,35.4 91.3,34.8 91.3,21 91,20.6 v90.9,20.5 | IC3.6 54.3,14.61 53.6,15.3 53.6,20.1 55.5,22 68.8,22 69.5,22.7 78.2,22.7 v79.3,21.6
PA13  (via drill 0.3)
  Top 0.2: U1.46 88.78,40.22 v89.2,40 | v81.4,22.31 81.5,22.31 v97.4,22.3
  Top 0.305: IC2.19 16.78,8.28 17.5,9 40,9 41,10 v41,16.5
  Bottom 0.2: v89.2,40 89.4,39.94 89.6,40.14 93.7,40.14 94.19,40.12 95.6,40.12 96.3,39.52 96.3,34.33 97.4,33.33 v97.4,22.3 | 43.5,23.5 44.2,24.2 68.6,24.2 68.8,24.4 80,24.4 81.1,23.3 81.1,22.61 v81.4,22.31
  Bottom 0.305: 43.5,23.5 42.5,22.5 42.5,18 v41,16.5
PA14  (via drill 0.3)
  Top 0.2: v72.75,48.5 74.8,48.5 75.9,49.5 78.8,49.5 80,48.4 v85.3,48.4 | U1.49 86.1,43.16 v86.38,42.84
  Top 0.305: v26.2,32.41 26.2,30.6 25,29.4 25,20.7 19.9,15.5 17.5,15.5 17,15 17,13 v16.5,12.5 | v21,7 21,2.76 IC2.21
  Bottom 0.2: 27.2,48.5 v72.75,48.5 | v85.3,48.4 85.46,48.4 85.5,48.44 86.16,48.44 86.6,48 86.6,43.06 v86.38,42.84
  Bottom 0.305: 27.2,48.5 26.2,47.5 v26.2,32.41 | v16.5,12.5 16.5,9 18.5,7 v21,7
PA15  (via drill 0.3)
  Top 0.2: U1.50 85.1,41.9 83.27,40.06 83.27,36.55 v83.31,36.3
  Bottom 0.2: RN1.1 87.8,25 88,25.2 88,28.6 88.3,28.9 88.3,30.8 88.11,31.09 88.11,32.3 84.1,36.3 v83.31,36.3
PB0  (via drill 0.3)
  Top 0.2: U1.26 82.67,30.86 82.6,30.8 82.6,28.7 v82.8,28.5 | X5.14 100.93,54.07 102.4,52.7 v102.4,51.9 | v99.4,23.4 83.5,23.4 80.3,26.4 v80.3,27.8
  Bottom 0.2: v102.4,51.9 102.4,38.6 101.3,37.5 101.3,25.3 v99.4,23.4 | v82.8,28.5 80.9,28.5 v80.3,27.8
PB1  (via drill 0.3)
  Top 0.2: v92.45,30.4 90.8,28.8 83.5,28.8 83,29.3 83,30.6 83.17,30.77 U1.27 | X4.14 99.64,35.66 99.3,36.1 97.7,36.1 95.8,34.2 95.8,31.1 96,30.9 v96,30.4
  Bottom 0.2: v92.45,30.4 v96,30.4
PB2  (via drill 0.3)
  Top 0.2: U1.28 83.67,30.46 v83.7,30.3
  Bottom 0.2: v83.7,30.3 81.22,30.3 R10.1
PB3  (via drill 0.3)
  Top 0.2: U1.55 82.67,43.84 84.33,45.44 87.17,45.44 v87.5,45
  Bottom 0.2: RN1.3 89.4,25.5 90.3,26.4 90.3,33.02 90.32,33.04 89.27,34.29 87.86,34.29 85,37.15 85,40.5 87.5,43 v87.5,45
PB4  (via drill 0.3)
  Top 0.2: U1.56 82.17,44 84.21,45.97 87.83,45.97 v88.2,45.6
  Bottom 0.2: RN1.4 90.2,24.8 90.8,25.4 90.8,33.36 90.82,33.38 89.47,34.92 88.1,34.92 85.48,37.49 85.48,40.23 88.4,43.1 88.4,45.3 v88.2,45.6
PB5  (via drill 0.3)
  Top 0.2: U1.57 81.67,40.52 v81.28,40.03
  Bottom 0.2: RN1.2 88.6,28.3 89,28.7 89,31 88.6,31.4 88.6,32.59 88.42,32.77 85.72,35.56 84.08,37.2 82.7,37.2 81.6,36.1 80.9,36.1 80.5,36.5 80.5,39.3 81.23,40.03 v81.28,40.03
PB6  (via drill 0.3)
  Top 0.2: U1.58 81.17,44.52 v80.77,45.45
  Top 0.305: U$2.13 72.7,56.83 73.03,57.15 v73.03,58.42
  Bottom 0.2: 75.56,57.78 75.56,46.09 76.21,45.45 v80.77,45.45
  Bottom 0.305: 75.56,57.78 74.93,58.42 v73.03,58.42
PB7  (via drill 0.3)
  Top 0.2: v79.41,46.23 79.41,45.7 80.67,44.34 U1.59
  Top 0.305: U$3.13 58.09,56.83 58.42,57.15 v58.42,58.32
  Bottom 0.2: 76.2,59.05 76.2,46.9 76.8,46.3 79.13,46.3 v79.41,46.23
  Bottom 0.305: v58.42,58.32 60.27,58.32 60.96,57.78 71.12,57.78 73.03,59.69 75.56,59.69 76.2,59.05
PB8  (via drill 0.3)
  Top 0.2: v76.81,47.33 76.83,47.06 76.83,46.38 77.47,45.74 78.24,45.74 79.67,44.32 U1.61
  Top 0.305: U$4.13 43.49,56.83 43.81,57.15 v43.81,58.42
  Bottom 0.2: 76.83,50.8 v76.81,47.33
  Bottom 0.305: v43.81,58.42 43.81,59.69 44.45,60.33 48.9,60.33 50.16,59.05 60.96,59.05 61.59,58.42 70.48,58.42 72.39,60.33 76.2,60.33 76.83,59.69 76.83,50.8
PB9  (via drill 0.3)
  Top 0.2: U1.62 79.17,44.15 78.11,45.21 76.89,45.21 75.9,46.2 75.9,47.7 76.4,48.2 77.64,48.2 v77.5,48.13
  Top 0.305: U$5.13 29.52,56.83 29.84,57.15 v29.84,58.42
  Bottom 0.305: v29.84,58.42 29.84,60.33 30.48,60.96 34.29,60.96 36.2,58.42 41.27,58.42 43.81,60.96 49.53,60.96 50.8,59.69 61.59,59.69 62.23,59.05 69.85,59.05 71.75,60.96 76.83,60.96 77.47,60.33 77.47,52.07 v77.5,48.13
PB10  (via drill 0.3)
  Top 0.2: U$10.11 92.57,59.43 94.25,57.45 94.25,52.76 96.5,50.3 96.45,40.8 96.85,40.4 96.85,36.19 95.3,34.63 95.3,27.32 92.38,24.4 v83.95,24.4 | U1.29 84.17,30.84 84.4,30.6 84.36,29.64 v84.36,29.45
  Bottom 0.2: v83.95,24.4 83.95,26.64 84,26.69 84,28.45 84.36,28.8 v84.36,29.45
PB11  (via drill 0.3)
  Top 0.2: U1.30 84.67,32.44 84.1,33.05 81.75,33.05 v81.2,33.5 | v73.9,32.8 67.8,32.8 v67.4,33.2
  Bottom 0.2: v81.2,33.5 80.9,33.5 80.6,33.2 75.5,33.2 75,32.8 v73.9,32.8 | v67.4,33.2 62.4,38.2 58.79,38.2 U$13.P$4
PB12  (via drill 0.3)
  Top 0.2: U1.33 87.61,31.84 v87.01,31.23
  Top 0.305: IC2.7 14.78,24.94 v15.38,25.54
  Bottom 0.2: v87.01,31.23 86.05,31.23 85.72,30.91 85.72,29.98 86,29.7 86,28.5 85.7,28.2 85.72,23.82 85,23.1 82.6,23.1 82.1,23.6 82.1,24.6 81.17,25.43 62.87,25.43 62.55,25.75 61.4,25.75 61.05,25.4 18.5,25.4 18.4,25.3 17.3,25.3 17.07,25.54 v15.38,25.54
PB13  (via drill 0.3)
  Top 0.2: U$2.3 80.38,56.17 81.31,55.24 81.31,51.89 82,51.2 88.2,51.2 92.7,46.7 92.7,33.04 91.14,31.48 90.72,31.5 89.1,31.5 | U1.34 88.34,34.22 88.9,33.66 88.9,31.5 89.1,31.5 | v87.6,30.15 87.9,30.3 89.1,31.5 | U$13.P$5 59.82,39.38 60.3,38.9 60.3,30.2 59.4,29.3 59.4,26.8 v60.05,26.25
  Top 0.305: U$2.3 73.32,56.17 v73.03,55.88 | U$3.3 58.72,56.17 v58.42,55.88 | U$4.3 44.11,56.17 v43.81,55.88 | U$5.3 30.14,56.17 v29.84,55.88 | v13.97,16.51 16.78,19.95 IC2.6 16.78,25.28 v17.5,26
  Bottom 0.2: v17.5,26 60.15,26 | v87.6,30.15 87.6,30.5 87.7,30.6 87.7,31.7 87.3,32.1 85.7,32.1 85.3,31.6 85.3,29.9 85.5,29.7 85.5,28.6 85.3,28.4 85.3,24.5 84.5,23.7 83.1,23.7 82.6,24.2 82.6,24.9 81.4,26 63.05,25.95 62.7,26.3 61.25,26.3 60.95,26 60.15,26 | 60.15,26 v60.05,26.25
  Bottom 0.305: v29.84,55.88 31.8,55.9 32.7,55 40.62,55 41.51,55.88 v43.81,55.88 47.1,56 48.6,57.3 54.2,57.3 55.58,55.88 v58.42,55.88 63.5,55.88 64.14,56.52 66.04,56.52 66.67,55.88 v73.03,55.88 | v13.97,16.51 9.53,16.51 8.7,15.69 U$8.24
PB14  (via drill 0.3)
  Top 0.2: U1.35 89.11,34.72 89.57,34.35 v89.57,32.69 | v86.36,27.91 v89.57,27.91 | U$13.P$7 60.88,41.92 61.3,41.5 61.3,25.71 v62.1,24.91
  Top 0.305: v10.79,14.61 12.78,17.07 IC2.8 12.78,24.21 v13.34,24.77
  Bottom 0.2: v89.57,27.91 v89.57,32.69 | v86.36,27.91 86.36,23.16 85.8,22.7 82.1,22.7 81.6,23.2 81.6,24 80.83,24.77 62.75,24.8 62.59,24.91 v62.1,24.91 61.66,24.91 61.5,24.75 v13.34,24.77
  Bottom 0.305: v10.79,14.61 10.79,10.16 11.43,9.53 13.34,9.53 13.7,9.16 U$8.21
PB15  (via drill 0.3)  (1 unrouted)
  Top 0.2: U$2.2 80.06,55.52 80.78,54.71 80.78,51.62 81.7,50.7 87.9,50.7 92.1,46.5 92.1,41.75 v91.4,41.05 91.44,40.75 91.44,39.96 92.1,39.4 92.14,35.56 91.69,35.22 U1.36 | v80.4,21.6 v98.1,21.6 | U$13.P$6 60.45,40.65 60.8,40.3 60.8,24.2 v61.4,23.45
  Top 0.305: v15.24,14.61 15.24,16.51 18.78,20.05 IC2.5
  Bottom 0.2: v91.4,41.05 93.4,41.05 93.8,41.01 95.8,41.01 96.8,40.3 96.8,34.74 98.2,33.44 98.2,22.2 v98.1,21.6 | 46,22.5 46,22.7 46.9,23.6 58.45,23.6 58.6,23.45 v61.4,23.45 62.05,23.45 62.2,23.6 68.7,23.6 69.1,24 79.3,24 80.2,23.1 80.2,21.8 v80.4,21.6
  Bottom 0.305: v15.24,14.61 15.24,8.89 14.7,8.35 U$8.20 14.7,6.3 15.81,5.19 44.06,5.19 45.38,6.19 45.38,10.5 45.35,11 45.35,13.5 45.38,14 45.38,22 45.88,22.5
PC0  (via drill 0.3)
  Top 0.2: U1.8 79.42,37.72 80.9,39.2 81.6,39.2 82.2,39.8 82.2,40.3 82.81,40.91 v82.81,41.47 | v83.22,52.66 83.22,53.12 83.7,53.6 84.1,53.6 85.2,54.7 86.4,54.7 86.6,54.5 86.6,53.62 U$10.2
  Bottom 0.2: v83.22,52.66 83.22,52.23 83.19,51.16 83.19,41.8 83.05,41.66 v82.81,41.47
PC1  (via drill 0.3)
  Top 0.2: U1.9 80.25,37.22 v81.46,38.51 | v85,52.52 86.83,52.52 87.3,53 87.3,53.57 U$10.3
  Bottom 0.2: v81.46,38.51 81.46,38.56 83.8,40.9 83.8,51.33 v85,52.52
PC2  (via drill 0.3)
  Top 0.2: U$10.4 87.92,53.02 86.8,51.9 85.97,51.9 v85.86,51.89 | U1.10 80.74,36.72 v81.44,37.41
  Bottom 0.2: v81.44,37.41 81.61,37.41 82.6,38.4 82.6,38.9 84.4,40.7 84.4,50.44 v85.86,51.89
PC3  (via drill 0.3)
  Top 0.2: U$10.5 88.58,51.62 90.7,49.5 92.6,49.5 93.2,48.9 93.2,28.55 91.8,27.2 85.2,27.2 v84.65,27.65 | U1.11 77.69,36.22 78,35.9 78,35.8 78.4,35.4 80.3,35.4 82,33.7 v83.5,33.7
  Bottom 0.2: v83.5,33.7 84,33.7 84.9,32.8 84.9,29.8 85.1,29.6 85.1,28.8 84.65,28.2 v84.65,27.65
PC4
  Top 0.2: U$10.6 89.22,51.58 90.97,49.93 92.97,49.93 93.75,49.16 93.75,28.27 92.11,26.64 82.15,26.64 81.67,27.23 U1.24
PC5  (via drill 0.3)
  Top 0.2: U$10.7 89.88,51.59 91.2,50.37 93.31,50.37 94.28,49.4 94.28,27.94 92.34,26 v82.95,26 | U1.25 82.17,28 v82.55,27.51
  Bottom 0.2: v82.95,26 82.9,26.1 82.55,26.45 v82.55,27.51
PC6  (via drill 0.3)
  Top 0.2: U$10.8 90.53,51.72 91.34,50.9 93.55,50.9 94.81,49.63 94.8,37.5 94.92,37.38 v94.92,37.09 | U1.37 90.81,35.72 91.4,36.3 91.4,36.99 v91.41,37.09
  Bottom 0.2: v91.41,37.09 v94.92,37.09
PC7  (via drill 0.3)
  Top 0.2: U$10.9 91.17,51.7 91.54,51.34 93.78,51.34 95.25,49.87 95.3,39.85 95.45,39.7 v95.45,39.22 | U1.38 90.42,36.22 90.8,36.6 90.8,37.99 v91.39,38.68
  Bottom 0.2: v91.39,38.68 93.27,38.68 94,39.22 v95.45,39.22
PC8  (via drill 0.3)
  Top 0.2: U1.39 86.8,36.72 86.34,36.25 86.34,35.31 86.35,34.9 86.35,30.7 86.65,30.45 v86.65,30.12
  Bottom 0.2: v86.65,30.12 86.65,29.31 87.5,28.56 87.5,27.52 86.88,26.9 86.88,20.94 85.31,19.38 79.06,19.38 R3.2
PC9  (via drill 0.3)
  Top 0.2: X4.10 97.55,33.66 97,33.1 v96.5,33.1 | U1.40 89.48,37.22 v90.1,37.2
  Bottom 0.2: v90.1,37.2 90.4,37.2 91.1,37.9 95,37.9 95.7,37.2 95.7,34 96.5,33.4 v96.5,33.1
PC10  (via drill 0.3)
  Top 0.2: U1.51 84.67,43.84 85.2,44.38 86.03,44.38 86.6,43.8 89.22,43.77 v90.17,44.94 | X5.10 98.47,52.07 97.7,51.4 97.7,45.9 97.95,45.65 v97.95,45.05
  Bottom 0.2: v97.95,45.05 97.45,44.6 91.21,44.6 v90.17,44.94
PC11  (via drill 0.3)
  Top 0.2: U1.52 84.17,43.88 85.09,44.8 86.3,44.8 86.8,44.3 88.96,44.3 v89.89,46.01 | X4.13 99.38,35.16 v98.83,35.3
  Bottom 0.2: v89.89,46.01 98.79,46.01 99.5,45.2 99.5,36.2 98.8,35.5 v98.83,35.3
PC12  (via drill 0.3)
  Top 0.2: U1.53 83.67,41.16 82.8,40.3 82.77,37.53 81.25,36.01 v79.19,36.01 | v70.56,33.54 v74.59,33.54
  Top 0.305: v6.56,25 6.56,22.76 IC2.11
  Bottom 0.2: v79.19,36.01 77.06,36.01 v74.59,33.54 | v70.56,33.54 70.1,33.54 68.47,31.91 68.38,31.77 67.75,31.15 27.76,31.2
  Bottom 0.305: 27.76,31.2 26.56,30 7.5,30 6.56,29.06 v6.56,25
PC13  (via drill 0.3)
  Top 0.2: v73.66,40.64 76.14,40.64 U1.2
  Top 0.305: v15.43,27.3 14.8,27.3 14,26.5 11.5,26.5 10.78,25.78 IC2.9
  Bottom 0.2: v15.43,27.3 46.7,27.3 46.9,27.5 47.95,27.5 48.15,27.3 58.25,27.3 58.75,27.8 62.9,27.8 63.4,27.3 72.39,27.3 73.12,28.04 73.12,40.12 v73.65,40.65 73.65,40.7 v73.66,40.64
R1
  Top 0.305: U$2.5 80.97,57.48 81.28,57.78 81.28,61.59 83.19,63.5 85.72,63.5 87.63,65.41 87.63,67.31 89.39,69.02 89.39,73.81 88.9,74.3 86.36,74.3 85.72,73.66 X2.6
R2  (via drill 0.3)
  Top 0.305: U$2.6 80.35,58.12 80.64,58.42 v80.64,62.87 | v79.38,66.67 79.38,74.3 80.01,74.93 80.01,76.83 79.38,77.47 73.66,77.47 73.03,76.83 X8.6
  Bottom 0.305: v80.64,62.87 80.64,64.77 79.38,66.04 v79.38,66.67
R3  (via drill 0.3)
  Top 0.305: U$2.7 73.94,58.77 73.66,59.05 73.66,62.23 73.03,62.87 68.58,62.87 v66.67,64.03 | v60.96,64.77 59.05,64.77 58.42,65.41 58.42,75.56 57.78,76.2 v50.8,76.2 | v46.99,76.2 38.73,76.2 37.47,74.93 X3.6
  Bottom 0.305: v60.96,64.77 65.41,64.77 66.09,64.03 v66.67,64.03 | v46.99,76.2 v50.8,76.2
R4  (via drill 0.3)
  Top 0.305: U$2.8 79.11,59.42 79.38,59.69 v79.38,62.87 | X9.6 62.87,76.2 63.5,76.83 67.25,76.85 67.4,77 68.25,77 68.42,76.83 v70.48,76.83 | v78.74,75.56 78.74,67.94 78.11,67.31 v78.11,66.67
  Bottom 0.305: v78.11,66.67 78.11,65.41 79.38,64.14 v79.38,62.87 | v70.48,76.83 78.11,76.83 78.74,76.2 v78.74,75.56
R5  (via drill 0.3)
  Top 0.305: U$2.9 68.21,59.42 67.31,60.33 v67.31,62.23 | v67.94,67.31 67.94,68.58 67.31,69.22 67.31,72.39 67.94,73.03 v67.94,76.2 | X6.6 v24.77,76.83
  Bottom 0.305: v67.94,67.31 67.94,62.87 v67.31,62.23 | v67.94,76.2 67.31,76.2 66.04,77.47 25.4,77.47 v24.77,76.83
R6  (via drill 0.3)
  Top 0.305: U$2.10 72.11,58.77 72.39,59.05 v72.39,61.74 | X10.6 97.16,76.83 97.79,77.47 101.51,77.47 102.14,76.83 102.14,62.23 v100.88,60.96 | v91.44,61.59 92.71,61.59 93.98,60.33 96.52,60.33 v97.16,60.96
  Bottom 0.305: v72.39,61.74 72.81,61.74 72.95,61.6 77.47,61.59 78.11,60.96 78.11,58.42 78.74,57.78 87,57.78 90.81,61.59 v91.44,61.59 | v97.16,60.96 v100.88,60.96
R7  (via drill 0.3)
  Top 0.305: U$2.11 65.7,58.12 65.41,58.42 v65.41,62.23 | v60.96,62.87 59.69,62.87 57.78,64.77 57.78,74.93 57.15,75.56 52.07,75.56 51.44,74.93 50.8,74.93 50.16,74.3 X7.6
  Bottom 0.305: v60.96,62.87 63.5,62.87 64.14,62.23 v65.41,62.23
R8  (via drill 0.3)
  Top 0.3: X5.17 102.54,55.57 v103,55.11 | X4.17 102.16,37.16 v102.89,37.19 | v74.7,52.7 v78.4,52.7
  Top 0.305: U$2.12 66.36,57.48 v64.77,55.83
  Bottom 0.3: 103.2,52.6 103.2,37.5 v102.89,37.19 | 103.2,52.6 103.2,52.8 103,53 v103,55.11 | v64.77,55.83 64.77,55.58 65.4,55 72.1,55 v74.7,52.7 | v78.4,52.7 79.5,52.7 80.8,53.9 95.9,53.9 97.2,52.6 103.2,52.6
RESET  (via drill 0.3)
  Top 0.2: U1.7 75.09,38.22 73.12,36.25 v71.08,36.25 | v64.38,39.3 64.38,46.88 62.67,48.58 61.95,49.3 48.6,49.3 47.8,50.1 v44.3,50.1
  Top 0.305: 4.89,73.23 SW6.1 | 17.5,73.12 v11.88,73.12 | R4.1 17.45,59.98 25.62,51.8 25.62,51.42 v26.88,50.17
  Top 0.406: v5,73.12 4.89,73.23 | C16.2 17.5,74.86 17.5,73.12 17.45,73.08 R4.1
  Bottom 0.2: v71.08,36.25 67.12,36.25 v64.38,39.3
  Bottom 0.305: v26.88,50.17 44.23,50.17 v44.3,50.1
  Bottom 0.406: v11.88,73.12 v5,73.12
S_IR  (via drill 0.3)
  Top 0.2: X4.7 105.59,32.16 106.25,32.81 106.25,48.12 105.89,48.49 | 105.89,48.49 103.75,50.62 100.42,50.62 X5.7 | U$10.12 91.17,60.17 91.5,60.5 92.4,60.5 v95.6,57.1 | v106.2,56.7 106.2,48.8 105.89,48.49
  Bottom 0.2: v95.6,57.1 105.8,57.1 v106.2,56.7
TIR1  (via drill 0.3)
  Top 0.305: U$10.19 86.62,63.13 88.27,64.77 88.27,66.67 90.02,68.53 v90.02,75.03 | v83.19,75.56 X2.2
  Bottom 0.305: v90.02,75.03 90.02,75.67 89.53,76.2 83.82,76.2 v83.19,75.56
TIR2  (via drill 0.3)
  Top 0.305: U$10.18 87.28,58.06 87,57.78 85.09,57.78 v83.25,60.06 | X8.2 69.09,72.27 v68.58,71.66 | v80.64,71.12 v80.64,66.67
  Bottom 0.305: v68.58,71.66 69.7,71.66 69.8,71.75 80.01,71.75 v80.64,71.12 | v80.64,66.67 80.64,66.04 81.92,64.77 81.92,61.59 v83.25,60.06
TIR3  (via drill 0.3)
  Top 0.305: X3.2 v34.92,74.3 | v90.75,72.39 90.75,66.04 87.92,63.16 U$10.17
  Bottom 0.305: v34.92,74.3 34.92,74.93 35.56,75.56 42.55,75.56 45.09,73.03 52.07,73.03 54.61,75.56 57.15,75.56 58.42,74.3 58.42,73.66 59.05,73.03 66.04,73.03 66.67,72.39 v90.75,72.39
TIR4  (via drill 0.3)
  Top 0.305: X9.2 60.33,73.66 v59.69,74.3 | U$10.16 88.58,58.09 v88.9,57.78
  Bottom 0.305: v59.69,74.3 65.61,74.3 66.88,73.03 86.36,73.03 87.63,74.3 88.9,74.3 89.53,73.66 90.81,73.66 92.08,74.93 99.69,74.93 100.33,74.3 100.33,63.5 99.69,62.87 97.79,62.87 97.16,63.5 94.61,63.5 93.34,62.23 93.34,59.69 92.71,59.05 90.17,59.05 v88.9,57.78
TIR5  (via drill 0.3)
  Top 0.305: U$10.15 89.22,63.19 91.44,65.41 91.44,74.3 92.08,74.93 v92.08,77.47 | X6.2 v22.23,76.2
  Bottom 0.305: v22.23,76.2 22.23,78.11 22.86,78.74 90.81,78.74 v92.08,77.47
TIR6
  Top 0.305: X10.2 93.22,72.27 92.08,71.12 92.08,64.77 89.88,62.57 U$10.14
TIR7  (via drill 0.3)
  Top 0.305: X7.2 47.12,72.27 45.72,73.66 45.72,74.3 v46.35,74.93 | U$10.13 90.53,58.06 v90.81,57.78
  Bottom 0.305: v46.35,74.93 51.44,74.93 53.34,76.83 65.41,76.83 67.31,74.93 78.11,74.93 78.74,74.3 79.38,74.3 82.55,77.47 90.81,77.47 92.08,76.2 97.16,76.2 98.42,77.47 100.33,77.47 100.97,76.83 100.97,62.87 100.33,62.23 97.16,62.23 96.52,62.87 95.25,62.87 93.98,61.59 93.98,58.42 93.34,57.78 v90.81,57.78
USB5V  (via drill 0.3)
  Top 0.61: R12.2 68.25,18.45 v70.3,20.6
  Bottom 0.61: 60.96,17.2 60.96,18.41 63.16,20.61 70.22,20.61 L2.1 70.43,20.4 70.4,20.4 70.3,20.5 v70.3,20.6 | 60.96,17.2 IC3.1 | 60.96,17.2 55.88,17.2 IC3.8
VDD1.8V  (1 unrouted)
  Bottom 0.61: U$8.17 25.75,10.2 R14.1
VDD3.3V  (via drill 0.3, 0.5)
  Top 0.2: 88.12,41.27 87.97,41.22 U1.48 85.42,41.22 84,39.8 84,35.9 83.85,35.75 | QG1.P$4 68.7,40.25 67.5,41.45 66.25,41.45 65.62,42.08 65.62,48 66.25,48.62 71.88,48.62 | X5.3 99.51,48.57 v99.05,48.11 | 78.12,43.12 U1.64 | 83.85,35.75 v83.5,35.4 | U1.32 85.67,32.78 84.8,33.65 84.8,34.8 83.85,35.75 | v79.2,34.65 79.2,31.8 U1.19 79.17,29.65 C1.1 77.48,27.76 C3.1 | v20.2,70.5 20.2,71.08 R4.2
  Top 0.3: 75.44,43.94 76.25,43.12 | v26.02,53.98 25.52,53.98 18.8,60.7 18.8,69.42 19.38,70 | 76.3,49 78.2,49 79.69,47.61 81.4,47.61 | v81.8,47.61 88.04,47.61 88.8,47.12 89.28,47.1 v89.55,47.1 90.2,47.1 91.1,46.2 91.1,44.3 89.22,42.42 88.12,41.27 | 99.15,31.14 99.16,30.94 99.5,30.6 100.31,30.6 X4.4 X4.3
  Top 0.305: C26.2 | U$4.16 C24.2 | U$5.16 27.31,53.03 C25.2 | R4.2 19.35,70.03 19.38,70 | X5.3 X5.4 | v99.15,31.26 99.15,31.14 | 76.25,43.12 78.12,43.12 | 75.44,43.94 v75.39,43.99 | U$10.20 85.97,60.42 85.2,61.2 83,61.2 82.1,60.3 v82.1,52.7 | 81.4,47.61 v81.8,47.61 | 76.3,49 76,49 74,47
  Top 0.406: C26.2 U$2.16 69.59,53.98 v68.58,53.98 | v39.37,53.98 40.38,53.98 U$4.16 | v53.98,53.98 54.99,53.98 U$3.16 C13.2 | v26.02,53.98 26.41,53.98 U$5.16 | C26.2 70.59,53.12 71.88,53.12 72.5,52.5 72.5,50 71.88,49.38 71.88,48.62 71.9,48.6 71.9,47.9 72.6,47.2 73.8,47.2 74,47 75.44,45.56 75.44,43.94 | R11.1 76.99,3.91 75.5,5.4 v75.5,11.6 | D2.2 75.12,15.98 75.5,15.6
  Top 0.61: IC2.17 12.7,2.62 12.7,11.43 12.06,12.06 9.53,12.06 8.78,12.81 IC2.10 | IC2.10 8.89,22.65 | IC2.10 8.75,22.57 8.75,25.48 | v39.37,53.98 39,53.6 39,48.1 37.4,46.5 v37.4,45.9 37.6,45.7 41.8,45.7 42.2,45.3 42.2,31.9 42.5,31.6 | v75.5,11.6 75.5,15.6 75.5,20 73.6,21.9 51.1,21.9 49.9,23.1 49.9,28.5 49.4,29 48.4,29 45.8,31.6 42.5,31.6 | R11.1 100.62,3.91 R8.2 | 8.75,25.48 C5.1 | 8.75,25.48 8.75,26.52 C27.1 20.54,29.16 v21.1,28.6 | v33.7,30.3 35.1,31.6 42.5,31.6
  Bottom 0.2: v83.5,35.4 79.8,35.4 v79.2,34.65 | R6.1 12.84,67.64 14.8,69.6 19.3,69.6 v20.2,70.5
  Bottom 0.3: v89.55,47.1 90.31,48.11 v99.05,48.11 100.7,46.66 100.7,31.8 100.01,31.31 99.3,31.31 v99.15,31.26
  Bottom 0.305: v82.1,52.7 82.1,47.91 v81.8,47.61 | L1.1 66.8,44.6 67.4,44 75.38,44 v75.39,43.99
  Bottom 0.406: v26.02,53.98 v39.37,53.98 v53.98,53.98 57.15,53.98 58.42,54.01 66.04,54.01 67.31,53.98 v68.58,53.98 | C37.1 56.18,35.57 | v75.5,11.6 77.75,11.6 L4.2 | C6.1 73.83,45.55 v75.39,43.99
  Bottom 0.61: 56.18,35.57 U$13.P$2 | C37.1 C38.1 56.1,37.65 56.1,40.5 52.1,44.5 37.5,44.5 | 37.5,44.5 R2.1 | 37.5,44.5 37.4,44.4 v37.4,45.9 | L4.2 75.55,11.65 v75.5,11.6 | v21.1,28.6 31.9,28.6 v33.7,30.3
VDD12V  (via drill 0.3, 0.5)  (3 unrouted)
  Top 0.2: X4.16 100.36,36.3 100.31,36.35 | 100.31,36.35 100.62,36.25 | 100.31,36.35 100.31,36.56 | v104.69,53.75 104.69,54.06
  Top 0.3: 101.33,54.57 X5.15 | X5.16 101.03,55.07 102.3,53.8
  Top 0.406: 101.33,54.57 102.1,53.8 102.3,53.8 | v104.69,53.75 104.64,53.8
  Top 0.61: v104.69,48.75 104.7,44.09 104.7,40.05 105,39.75 105,37.19 104.06,36.35 100.31,36.35 | 95.89,77.48 97.2,78.65 104.1,78.65 105.1,77.7 105.1,54.16 v104.69,53.75 | 104.64,53.8 102.3,53.8 | 22.86,22.62 22.86,33.26 25,35.4 25,38.15 R19.1 24.95,40.55 v24.6,40.9 | X6.1 22.23,66.72 v22.2,66.7 | 47.5,68.58 X7.1 47.62,66.92 | v34.8,66.7 34.8,68.58 X3.1 34.92,66.83 v34.8,66.7 | v60.3,66.8 60.3,68.68 X9.1 60.33,66.83 v60.3,66.8 | v70.5,66.8 70.5,68.69 X8.1 70.48,66.81 v70.5,66.8 | v83.1,66.8 83.1,68.62 X2.1 83.19,66.89 v83.1,66.8 | v94.5,66.8 94.5,68.59 X10.1 94.61,66.92 v94.5,66.8
  Top 0.813: X6.4 23.5,77.47 24.13,78.11 | 36.2,78.44 24.52,78.44 24.13,78.11 | 36.2,78.44 48.9,78.44 | 48.9,78.44 61.59,78.44 | 61.59,78.44 71.75,78.44 | 71.75,78.44 84.45,78.44 | 84.45,78.44 95.11,78.44 95.89,77.47 X10.4 95.89,77.48 | 84.45,78.44 X2.4 | 71.75,78.44 X8.4 | 48.9,78.44 X7.4 | 61.59,78.44 X9.4 | 36.2,78.44 X3.4 | v8.89,53.9 8.89,75.56 11.43,78.11 24.13,78.11
  Bottom 0.2: v47.5,66.7 47.6,66.8
  Bottom 0.61: v104.69,53.75 v104.69,48.75 | v24.6,40.9 24.6,42.3 14.4,52.5 10.29,52.5 v8.89,53.9 8.89,60.69 10.5,62.3 17.8,62.3 v22.2,66.7 v34.8,66.7 v47.5,66.7 | 47.6,66.8 v60.3,66.8 65.5,66.8 67.1,68.4 68.8,68.4 70.4,66.8 v70.5,66.8 71.9,66.8 73.1,68 81.4,68 82.6,66.8 v83.1,66.8 v94.5,66.8

## Text on the board
Bottom: das-labor.org | Rev 1.0